# EasyEDA Pro project stm32_lora.eprj

# Schematic Schematic1
Board Name: Board1; Create Date: 2026-04-03; Page Name: P1; Project Name: pic24LoraAlpha; Schematic Name: Schematic1; Update Date: 2026-04-12; Company: EasyEDA.com; Page Size: A4; Version: V1.0
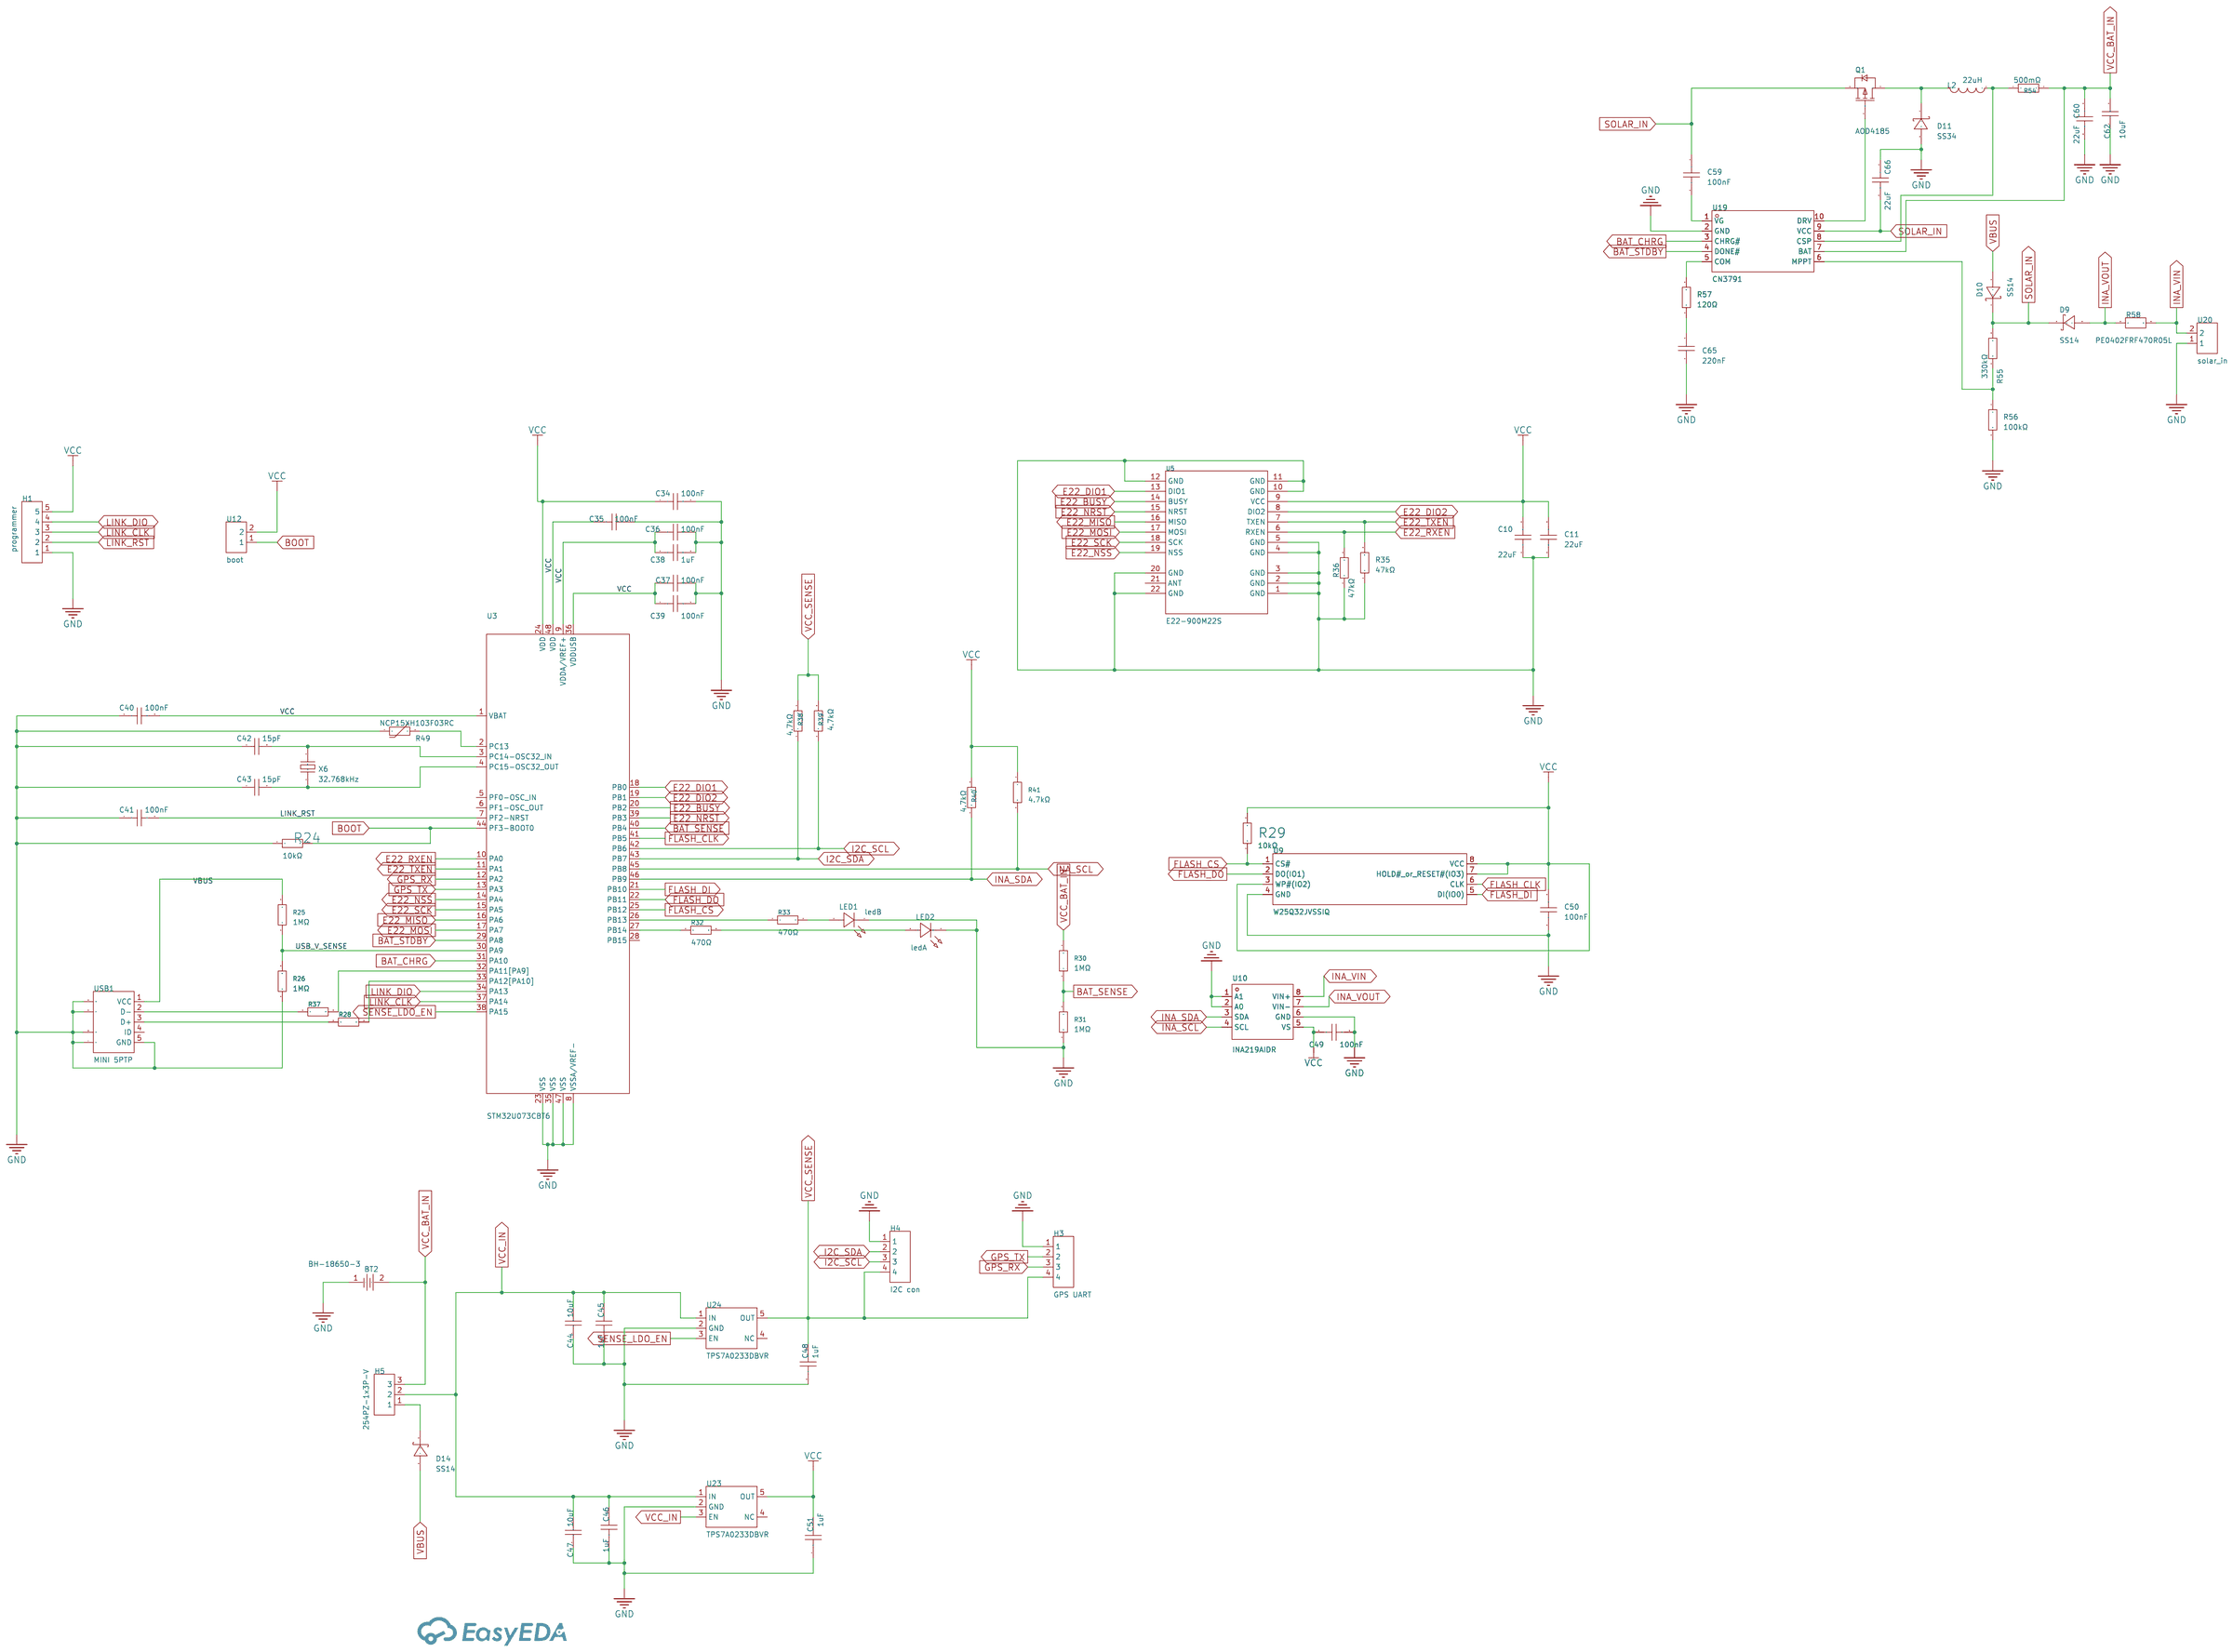
[diagram p0: schematic sheet]

## Parts
BT2  BH-18650-3  [BAT-TH_BH-18650-3]
C10  22uF  [C0603]
C11  22uF  [C0603]
C34  100nF  [C0402]
C35  100nF  [C0402]
C36  100nF  [C0402]
C37  100nF  [C0402]
C38  1uF  [C0402]
C39  100nF  [C0402]
C40  100nF  [C0402]
C41  100nF  [C0402]
C42  15pF  [C0402]
C43  15pF  [C0402]
C44  10uF  [C0402]
C45  1uF  [C0402]
C46  1uF  [C0402]
C47  10uF  [C0402]
C48  1uF  [C0402]
C49  100nF  [C0402]
C50  100nF  [C0402]
C51  1uF  [C0402]
C59  100nF  [C0402]
C60  22uF  [C0603]
C62  10uF  [C0402]
C65  220nF  [C0402]
C66  22uF  [C0603]
D9  SS14  [SMA_L4.2-W2.6-LS5.0-RD_1]
D10  SS14  [SMA_L4.2-W2.6-LS5.0-RD_1]
D11  SS34  [SMA_L4.3-W2.6-LS5.2-RD]
D14  SS14  [SMA_L4.2-W2.6-LS5.0-RD_1]
H1  programmer  [HDR-TH_5P-P2.54-V-M]  (no BOM)
H3  GPS UART  [HDR-TH_4P-HX-PH254-01-04-Z-L11.5]  (no BOM)
H4  I2C con  [HDR-TH_4P-HX-PH254-01-04-Z-L11.5]  (no BOM)
H5  254PZ-1x3P-V  [HDR-TH_3P-P2.54-V-M]  (no BOM)
L2  22uH  [IND-SMD_L4.0-W4.0_SLW4010S]
LED1  ledB  [LED0603-RD]  (no BOM)
LED2  ledA  [LED0603-RD]  (no BOM)
Q1  AOD4185  [TO-252-3_L6.5-W5.8-P4.60-LS9.9-BR]
R24  10kΩ  [R0603]
R25  1MΩ  [R0402]
R26  1MΩ  [R0402]
R28  22Ω  [R0402]
R29  10kΩ  [R0603]
R30  1MΩ  [R0402]
R31  1MΩ  [R0402]
R32  470Ω  [R0402]
R33  470Ω  [R0402]
R35  47kΩ  [R0402]
R36  47kΩ  [R0402]
R37  22Ω  [R0402]
R38  4.7kΩ  [R0402]
R39  4.7kΩ  [R0402]
R40  4.7kΩ  [R0402]
R41  4.7kΩ  [R0402]
R49  NCP15XH103F03RC  [R0402]
R54  500mΩ  [R0805]
R55  330kΩ  [R0603]
R56  100kΩ  [R0603]
R57  120Ω  [R0402]
R58  PE0402FRF470R05L  [R0402]
U3  STM32U073CBT6  [LFQFP-48_L7.0-W7.0-P0.50-LS9.0-BL]
U5  E22-900M22S  [WIRELM-SMD_E22-900M22S]
U9  W25Q32JVSSIQ  [SOIC-8_L5.3-W5.3-P1.27-LS8.0-BL]
U10  INA219AIDR  [SOIC-8_L4.9-W3.9-P1.27-LS6.0-BL]
U12  boot  [CONN-TH_HC-PZ254-11.5L-1X2PZ]  (no BOM)
U19  CN3791  [SSOP-10_L4.9-W3.9-P1.00-LS6.0-BL]
U20  solar_in  [CONN-TH_HC-PZ254-11.5L-1X2PZ]  (no BOM)
U23  TPS7A0233DBVR  [SOT-23-5_L2.9-W1.6-P0.95-LS2.8-BL]
U24  TPS7A0233DBVR  [SOT-23-5_L2.9-W1.6-P0.95-LS2.8-BL]
USB1  MINI 5PTP  [MINI-USB-SMD_MINI-5PTP]
X6  32.768kHz  [CRYSTAL-SMD_L3.2-W1.5-1]

## Library data of the parts
BT2 = BH-18650-3: Supplier Part: C49118397; Manufacturer: HanElectricity(瀚源); Supplier Footprint: 插件; JLCPCB Part Class: Extended Part; Datasheet: https://item.szlcsc.com/datasheet/BH-18650-3/51502451.html; Supplier: LCSC
C10 C11 C60 C66 = CL10A226MQ8NRNC: LCSC Part Name: 22uF ±20% 6.3V; Supplier Part: C59461; Manufacturer: SAMSUNG(三星); Supplier Footprint: 0603; JLCPCB Part Class: Basic Part; Datasheet: https://item.szlcsc.com/datasheet/CL10A226MQ8NRNC/60514.html; Supplier: LCSC; Tolerance: ±20%; Voltage Rating: 6.3V; Temperature Coefficient: X5R
C34-C37 C39-C41 C49 C50 C59 = CL05B104KO5NNNC: LCSC Part Name: 100nF ±10% 16V; Supplier Part: C1525; Manufacturer: SAMSUNG(三星); Supplier Footprint: 0402; JLCPCB Part Class: Basic Part; Datasheet: https://item.szlcsc.com/datasheet/CL05B104KO5NNNC/1877.html; Supplier: LCSC; Tolerance: ±10%; Voltage Rating: 16V; Temperature Coefficient: X7R
C38 C45 C46 C48 C51 = CL05A105KA5NQNC: LCSC Part Name: 1uF ±10% 25V; Supplier Part: C52923; Manufacturer: SAMSUNG(三星); Supplier Footprint: 0402; JLCPCB Part Class: Basic Part; Datasheet: https://item.szlcsc.com/datasheet/CL05A105KA5NQNC/53938.html; Supplier: LCSC; Tolerance: ±10%; Voltage Rating: 25V; Temperature Coefficient: X5R
C42 C43 = 0402CG150J500NT: LCSC Part Name: 15pF ±5% 50V; Supplier Part: C1548; Manufacturer: FH(风华); Supplier Footprint: 0402; JLCPCB Part Class: Basic Part; Datasheet: https://item.szlcsc.com/datasheet/0402CG150J500NT/1900.html; Supplier: LCSC; Tolerance: ±5%; Voltage Rating: 50V; Temperature Coefficient: C0G
C44 C47 C62 = CL05A106MQ5NUNC: LCSC Part Name: 10uF ±20% 6.3V; Supplier Part: C15525; Manufacturer: SAMSUNG(三星); Supplier Footprint: 0402; JLCPCB Part Class: Basic Part; Datasheet: https://item.szlcsc.com/datasheet/CL05A106MQ5NUNC/16204.html; Supplier: LCSC; Tolerance: ±20%; Voltage Rating: 6.3V; Temperature Coefficient: X5R
C65 = CL05B224KO5NNNC: LCSC Part Name: 220nF ±10% 16V; Supplier Part: C16772; Manufacturer: SAMSUNG(三星); Supplier Footprint: 0402; JLCPCB Part Class: Basic Part; Datasheet: https://item.szlcsc.com/datasheet/CL05B224KO5NNNC/17456.html; Supplier: LCSC; Tolerance: ±10%; Voltage Rating: 16V; Temperature Coefficient: X7R
D9 D10 D14 = SS14_C2480: LCSC Part Name: 电压:40V 电流:1A; Supplier Part: C2480; Manufacturer: MDD(辰达半导体); Supplier Footprint: SMA(DO-214AC); JLCPCB Part Class: Basic Part; Datasheet: https://item.szlcsc.com/datasheet/SS14/2857.html; Supplier: LCSC; Diode Configuration: Independent; Voltage - Forward(Vf@If): 550mV@1A; Voltage - DC Reverse(Vr): 40V; Current - Rectified: 1A; Reverse Leakage Current (Ir): 300uA@40V; Operating Junction Temperature Range: -55℃~+150℃; Non-Repetitive Peak Forward Surge Current: 25A
D11 = SS34_C8678: LCSC Part Name: 电压:40V 电流:3A; Supplier Part: C8678; Manufacturer: MDD(辰达半导体); Supplier Footprint: SMA(DO-214AC); JLCPCB Part Class: Basic Part; Datasheet: https://item.szlcsc.com/datasheet/SS34/9178.html; Supplier: LCSC; Diode Configuration: Independent; Voltage - Forward(Vf@If): 550mV@3A; Voltage - DC Reverse(Vr): 40V; Current - Rectified: 3A; Reverse Leakage Current (Ir): 500uA@40V; Operating Junction Temperature Range: -55℃~+125℃
H1 = 22284050: LCSC Part Name: 针座; Supplier Part: C563741; Manufacturer: MOLEX; Supplier Footprint: 插件; JLCPCB Part Class: Extended Part; Datasheet: https://www.molex.com/content/dam/molex/molex-dot-com/products/automated/en-us/salesdrawingpdf/423/42375/022284050_sd.pdf?inline\; Supplier: LCSC
H3 H4 = HX PH254-01-04-Z-L11.5 straight pin header: LCSC Part Name: 1x4P 间距:2.54mm 方针 直插; Supplier Part: C52016392; Manufacturer: hanxia(韩下); Supplier Footprint: 插件,P=2.54mm; JLCPCB Part Class: Extended Part; Datasheet: https://item.szlcsc.com/datasheet/HX%2520PH254-01-04-Z-L11.5%2520straight%2520pin%2520header/54760437.html; Supplier: LCSC; Pin Structure: 1x4P; Pitch: 2.54mm; Circluar Pins/Square Pins: Pin Header; Mounting Type: Through Hole; Number of Rows: 1; Number of Pins: 4P; Current Rating: 3A; Voltage Rating (Max): 1kV; Length of Mating Pin: 6mm; Insulation Height: 2.5mm; Length of End Connection Pin: 3mm; Contact Material: Brass; Contact Plating: Gold; Operating Temperature: -40℃~+105℃
H5 = 254PZ-1x3P-V: LCSC Part Name: 1x3P 间距:2.54mm 方针 直插; Supplier Part: C53055673; Manufacturer: LXWCONN(连兴旺电子); Supplier Footprint: 插件,P=2.54mm; JLCPCB Part Class: Extended Part; Datasheet: https://item.szlcsc.com/datasheet/254PZ-1x3P-V/55999873.html; Supplier: LCSC; Pin Structure: 1x3P; Pitch: 2.54mm; Circluar Pins/Square Pins: Pin Header; Mounting Type: Through Hole; Number of Rows: 1
L2 = SWPA4030S220MT: LCSC Part Name: 22uH ±20% 1.3A; Supplier Part: C83472; Manufacturer: Sunlord(顺络); Supplier Footprint: SMD; JLCPCB Part Class: Extended Part; Datasheet: https://atta.szlcsc.com/upload/public/pdf/source/20231024/317626D2AA2F8AB4113C1875E432E6E1.pdf; Supplier: LCSC; Tolerance: ±20%; Saturation Current (Isat): 1.3A
LED1 LED2 = 19-217/G7C-AM1N2B/6T: LCSC Part Name: 发光二极管; Supplier Part: C2987554; Manufacturer: EVERLIGHT(亿光); Supplier Footprint: 0603; JLCPCB Part Class: Extended Part; Supplier: LCSC; Illumination Color: Yellow Green; Voltage - Forward(Vf): 1.75V~2.35V; Power(Watts): 60mW; Wavelength - Dominant: 569.5nm~577.5nm; Peak Wavelength: 575nm; Lens Color: Water Clear; Luminous Intensity: 18mcd~45mcd; Viewing Angle: 120°; Operating Temperature: -40℃~+85℃
Q1 = AOD4185_C5261064: LCSC Part Name: 1个P沟道 耐压:40V 电流:40A; Supplier Part: C5261064; Manufacturer: HXY MOSFET(华轩阳电子); Supplier Footprint: TO-252-2L; JLCPCB Part Class: Extended Part; Datasheet: https://item.szlcsc.com/datasheet/AOD4185/5983763.html; Supplier: LCSC; Number: 1 P-Channel; Drain to Source Voltage: 40V; Current - Continuous Drain(Id): 40A; RDS(on): 19mΩ@10V; Pd - Power Dissipation: 40.3W; Input Capacitance(Ciss): 2.525nF
R24 R29 = 0603WAF1002T5E: LCSC Part Name: 厚膜电阻 10kΩ ±1% 100mW; Supplier Part: C25804; Manufacturer: UNI-ROYAL(厚声); Supplier Footprint: 0603; JLCPCB Part Class: Basic Part; Datasheet: https://item.szlcsc.com/datasheet/0603WAF1002T5E/26547.html; Supplier: LCSC; Type: Thick Film Resistor; Tolerance: ±1%; Power(Watts): 100mW; Voltage-Supply(Max): 75V; Temperature Coefficient: ±100ppm/℃; Operating Temperature: -55℃~+155℃
R25 R26 R30 R31 = 0402WGF1004TCE: LCSC Part Name: 1MΩ ±1% 62.5mW 厚膜电阻; Supplier Part: C26083; Manufacturer: UNI-ROYAL(厚声); Supplier Footprint: 0402; JLCPCB Part Class: Basic Part; Datasheet: https://item.szlcsc.com/datasheet/0402WGF1004TCE/26826.html; Supplier: LCSC; Type: Thick Film Resistor; Tolerance: ±1%; Power(Watts): 62.5mW; Voltage-Supply(Max): 50V; Temperature Coefficient: ±100ppm/℃; Operating Temperature: -55℃~+155℃
R28 R37 = 0402WGF220JTCE: LCSC Part Name: 22Ω ±1% 62.5mW 厚膜电阻; Supplier Part: C25092; Manufacturer: UNI-ROYAL(厚声); Supplier Footprint: 0402; JLCPCB Part Class: Basic Part; Datasheet: https://atta.szlcsc.com/upload/public/pdf/source/20200306/C422600_1E6D84923E4A46A82E41ADD87F860B5C.pdf; Supplier: LCSC; Type: Thick Film Resistors; Tolerance: ±1%; Temperature Coefficient: ±100ppm/℃; Operating Temperature Range: -55℃~+155℃
R32 R33 = 0402WGF4700TCE: LCSC Part Name: 470Ω ±1% 62.5mW 厚膜电阻; Supplier Part: C25117; Manufacturer: UNI-ROYAL(厚声); Supplier Footprint: 0402; JLCPCB Part Class: Basic Part; Datasheet: https://item.szlcsc.com/datasheet/0402WGF4700TCE/25860.html; Supplier: LCSC; Type: Thick Film Resistor; Tolerance: ±1%; Power(Watts): 62.5mW; Voltage-Supply(Max): 50V; Temperature Coefficient: ±100ppm/℃; Operating Temperature: -55℃~+155℃
R35 R36 = 0402WGF4702TCE: LCSC Part Name: 47kΩ ±1% 62.5mW 厚膜电阻; Supplier Part: C25792; Manufacturer: UNI-ROYAL(厚声); Supplier Footprint: 0402; JLCPCB Part Class: Basic Part; Datasheet: https://item.szlcsc.com/datasheet/0402WGF4702TCE/26535.html; Supplier: LCSC; Type: Thick Film Resistor; Tolerance: ±1%; Power(Watts): 62.5mW; Voltage-Supply(Max): 50V; Temperature Coefficient: ±100ppm/℃; Operating Temperature: -55℃~+155℃
R38-R41 = 0402WGF4701TCE: LCSC Part Name: 4.7kΩ ±1% 62.5mW 厚膜电阻; Supplier Part: C25900; Manufacturer: UNI-ROYAL(厚声); Supplier Footprint: 0402; JLCPCB Part Class: Basic Part; Datasheet: https://item.szlcsc.com/datasheet/0402WGF4701TCE/26643.html; Supplier: LCSC; Type: Thick Film Resistor; Tolerance: ±1%; Power(Watts): 62.5mW; Voltage-Supply(Max): 50V; Temperature Coefficient: ±100ppm/℃; Operating Temperature: -55℃~+155℃
R49 = NCP15XH103F03RC: LCSC Part Name: 10kΩ 3380K 100mW; Supplier Part: C77131; Manufacturer: muRata(村田); Supplier Footprint: 0402; JLCPCB Part Class: Extended Part; Datasheet: https://item.szlcsc.com/datasheet/NCP15XH103F03RC/78258.html; Supplier: LCSC; Resistance @ 25℃: 10kΩ; B Constant (25℃/50℃): 3380K; Resistance Tolerance: ±1%; B Constant (25℃/85℃): 3434K; B Constant (25℃/100℃): 3455K; Power(Watts): 100mW; B Constant Tolerance: ±1%; Steady State Current (Max): 310uA; Operating Temperature: -40℃~+125℃; Dissipation Factor: 1mW/℃; Length: 1mm; Width: 0.5mm
R54 = 0805W8F500LT5E: LCSC Part Name: 500mΩ ±1% 125mW 厚膜电阻; Supplier Part: C28319; Manufacturer: UNI-ROYAL(厚声); Supplier Footprint: 0805; JLCPCB Part Class: Extended Part; Datasheet: https://atta.szlcsc.com/upload/public/pdf/source/20200306/C422600_1E6D84923E4A46A82E41ADD87F860B5C.pdf; Supplier: LCSC; Type: Thick Film Resistors; Tolerance: ±1%; Temperature Coefficient: ±800ppm/℃; Operating Temperature Range: -55℃~+155℃
R55 = 0603WAF3303T5E: LCSC Part Name: 330kΩ ±1% 100mW 厚膜电阻; Supplier Part: C23137; Manufacturer: UNI-ROYAL(厚声); Supplier Footprint: 0603; JLCPCB Part Class: Basic Part; Datasheet: https://atta.szlcsc.com/upload/public/pdf/source/20200306/C422600_1E6D84923E4A46A82E41ADD87F860B5C.pdf; Supplier: LCSC; Type: Thick Film Resistors; Tolerance: ±1%; Temperature Coefficient: ±100ppm/℃; Operating Temperature Range: -55℃~+155℃
R56 = 0603WAF1003T5E: LCSC Part Name: 100kΩ ±1% 100mW 厚膜电阻; Supplier Part: C25803; Manufacturer: UNI-ROYAL(厚声); Supplier Footprint: 0603; JLCPCB Part Class: Basic Part; Datasheet: https://item.szlcsc.com/datasheet/0603WAF1003T5E/26546.html; Supplier: LCSC; Type: Thick Film Resistor; Tolerance: ±1%; Power(Watts): 100mW; Voltage-Supply(Max): 75V; Temperature Coefficient: ±100ppm/℃; Operating Temperature: -55℃~+155℃
R57 = 0402WGF1200TCE: LCSC Part Name: 120Ω ±1% 62.5mW 厚膜电阻; Supplier Part: C25079; Manufacturer: UNI-ROYAL(厚声); Supplier Footprint: 0402; JLCPCB Part Class: Basic Part; Datasheet: https://item.szlcsc.com/datasheet/0402WGF1200TCE/25822.html; Supplier: LCSC; Type: Thick Film Resistor; Tolerance: ±1%; Power(Watts): 62.5mW; Voltage-Supply(Max): 50V; Temperature Coefficient: ±100ppm/℃; Operating Temperature: -55℃~+155℃
R58 = PE0402FRF470R05L: LCSC Part Name: 薄膜电阻 50mΩ ±1% 250mW; Supplier Part: C851623; Manufacturer: YAGEO(国巨); Supplier Footprint: 0402; JLCPCB Part Class: Extended Part; Datasheet: https://item.szlcsc.com/datasheet/PE0402FRF470R05L/911941.html; Supplier: LCSC
U3 = STM32U073CBT6: Supplier Part: C27035627; Manufacturer: ST(意法半导体); Supplier Footprint: LQFP-48(7x7); JLCPCB Part Class: Extended Part; Datasheet: https://item.szlcsc.com/datasheet/STM32U073CBT6/28775735.html; Supplier: LCSC
U5 = E22-900M22S: LCSC Part Name: 868/915MHz贴片型LoRa模块; Supplier Part: C411293; Manufacturer: EBYTE(亿佰特); Supplier Footprint: SMD,20x14mm; JLCPCB Part Class: Extended Part; Datasheet: https://item.szlcsc.com/datasheet/E22-900M22S/402604.html; Supplier: LCSC; Output Power: 22.3dBm; Interface Type: SPI; Modulation System: LoRa；FSK; Voltage - Supply: 2.5V~3.7V; Antenna Type: Stamp Hole Antenna；IPEX interface; Receive  Current: 6.8mA; Send  Current: 119mA; Sensitivity: -147dBm; Communication Distance: 7km
U9 = W25Q32JVSSIQ: LCSC Part Name: 支持双线、四线SPI接口的3V、32Mbit 串行SPI闪存; Supplier Part: C179173; Manufacturer: Winbond(华邦); Supplier Footprint: SOIC-8-208mil; JLCPCB Part Class: Extended Part; Datasheet: https://item.szlcsc.com/datasheet/W25Q32JVSSIQ/190567.html; Supplier: LCSC; Interface: SPI; Memory Size: 32Mbit; Clock Frequency: 133MHz; Voltage - Supply: 2.7V~3.6V; Standby Supply Current: 1uA; Program / Erase Cycles: 100,000 Cycles; Page Programming Time (Tpp): 3ms; Data Retention - TDR (Year): 20 Years; Operating Temperature: -40℃~+85℃
U10 = INA219AIDR: LCSC Part Name: 零漂移双向电流/功率监测器带I2C接口; Supplier Part: C138706; Manufacturer: TI(德州仪器); Supplier Footprint: SOIC-8; JLCPCB Part Class: Extended Part; Datasheet: https://www.ti.com/cn/lit/gpn/ina219; Supplier: LCSC; Number of Channels: 1; Vcm - Common Mode Voltage: 0V~26V; Ib - Input Bias Current: 20nA; Vos - Input Offset Voltage: 10uV; Operating Temperature: -40℃~+125℃; Differential Voltage: ±26V; Maximum Power Supply Range (Vdd-Vss): 5.5V; Single Supply: 3V~5.5V; Quiescent Current: 700uA; Input Offset Voltage Drift(Vos TC): 0.1uV/℃; Common Mode Rejection Ratio (CMRR): 120dB
U12 U20 = HC-PZ254-11.5L-1x2PZ: LCSC Part Name: 1x2P 间距:2.54mm 方针 直插; Supplier Part: C27985187; Manufacturer: HC(虹成电子); Supplier Footprint: 插件,P=2.54mm; JLCPCB Part Class: Extended Part; Datasheet: https://item.szlcsc.com/datasheet/HC-PZ254-11.5L-1x2PZ/29721145.html; Supplier: LCSC; Pin Structure: 1x2P; Pitch: 2.54mm; Circluar Pins/Square Pins: Pin Header; Mounting Type: Through Hole; Number of Rows: 1; Number of Pins: 2P; Current Rating: 3A; Length of Mating Pin: 6mm; Insulation Height: 2.5mm; Length of End Connection Pin: 3mm; Contact Material: Brass; Contact Plating: Gold; Operating Temperature: -40℃~+105℃; Color: Black
U19 = CN3791: LCSC Part Name: 具有太阳能电池最大功率点跟踪功能的4A单节锂电池充电管理集成电路; Supplier Part: C154992; Manufacturer: CONSONANCE(上海如韵); Supplier Footprint: SSOP-10-150mil; JLCPCB Part Class: Extended Part; Datasheet: https://item.szlcsc.com/datasheet/CN3791/166334.html; Supplier: LCSC; The Chip Type: Charging IC; Voltage - Supply: 4.5V~28V; Charge Current - Max: 4A; Charging Saturation Voltage: 4.2V; Type of Battery: Lithium Battery; Number of Cells: 1; Operating Temperature: -40℃~+85℃; Battery Temperature Detection: Not supported; Supply Current (Iq): 15uA; Features: Constant voltage charging；Constant current charging；Charge termination；Automatic recharge；Soft start；Programmable charging current；Overvoltage protection；Undervoltage lockout；Trickle charging
U23 U24 = TPS7A0233DBVR: LCSC Part Name: 具有使能功能的 200mA、毫微功耗 IQ (25nA)、低压降 (LDO) 稳压器; Supplier Part: C5142805; Manufacturer: TI(德州仪器); Supplier Footprint: SOT-23-5; JLCPCB Part Class: Extended Part; Datasheet: https://www.ti.com/cn/lit/gpn/tps7a02; Supplier: LCSC; Output Type: Fixed; Voltage - Supply: 6V; Output Voltage: 3.3V; Output Current: 200mA; Power Supply Rejection Ratio (PSRR): 55dB@(1kHz); Voltage Dropout: 270mV@(200mA); standby current: 25nA; Noise: 130uVrms; Features: Thermal Shutdown；Enable；Over Temperature Protection；Over Current Protection; Operating Temperature: -40℃~+125℃@(Tj); Output Configuration: Positive; Number of Outputs: 1
USB1 = MINI 5PTP: LCSC Part Name: 5P卧贴母座; Supplier Part: C2681563; Manufacturer: SHOU HAN(首韩); Supplier Footprint: SMD; JLCPCB Part Class: Extended Part; Datasheet: https://item.szlcsc.com/datasheet/MINI%25205PTP/2774906.html; Supplier: LCSC; Connector Type: Mini-B; Protocol Standard: USB 2.0; Gender: Female; Mounting Type: Surface Mount, Right Angle; Number of Contacts: 5P; Number of Ports: 1; Current Rating-Power: 1A; Voltage Rating: 30V; Connect-Disconnect Life: 3,000 Cycles; Detection color: Black; Operating Temperature: -30℃~+80℃
X6 = FC-135R 32.7680KA-A3: LCSC Part Name: 32.768kHz ±20ppm 12.5pF; Supplier Part: C6554955; Manufacturer: EPSON(爱普生); Supplier Footprint: SMD3215-2P; JLCPCB Part Class: Extended Part; Datasheet: https://item.szlcsc.com/datasheet/FC-135R%252032.7680KA-A3/7508731.html; Supplier: LCSC; Normal temperature Frequency Tolerance: ±20ppm; Load Capacitance: 12.5pF; Equivalent Series Resistance(ESR): 50kΩ; Operating Temperature: -40℃~+85℃

## Nets
GND: BT2.1(-) C10.1 C11.1 C34.2 C35.2 C36.2 C37.2 C38.2 C39.2 C40.1 C41.1 C42.1 C43.1 C44.1 C45.1 C46.1 C47.1 C48.1 C49.2 C50.1 C51.1 C60.2 C62.1 C65.1 C66.1 D11.2(A) H1.1 H3.1 H4.1 LED1.1(K) LED2.1(K) R24.1 R26.1 R31.1 R35.1 R36.1 R49.1 R56.2 U3.8(VSSA/VREF-) U3.23(VSS) U3.35(VSS) U3.47(VSS) U5.1(GND) U5.2(GND) U5.3(GND) U5.4(GND) U5.5(GND) U5.10(GND) U5.11(GND) U5.12(GND) U5.20(GND) U5.22(GND) U9.4(GND) U10.1(A1) U10.2(A0) U10.6(GND) U19.2(GND) U20.1 U23.2(GND) U24.2(GND) USB1.5(GND) USB1.6(EH) USB1.7(EH) USB1.8(EH) USB1.9(EH)
VBUS: D10.2(A) D14.2(A) R25.2 USB1.1(VCC)
VCC: C10.2 C11.2 C34.1 C35.1 C36.1 C37.1 C38.1 C39.1 C40.2 C49.1 C50.2 C51.2 H1.5 R29.2 R40.2 R41.1 U3.1(VBAT) U3.9(VDDA/VREF+) U3.24(VDD) U3.36(VDDUSB) U3.48(VDD) U5.9(VCC) U9.3(WP#(IO2)) U9.7(HOLD# or RESET#(IO3)) U9.8(VCC) U10.5(VS) U12.2 U23.5(OUT)
VCC_BAT_IN: BT2.2(+) C60.1 C62.2 H5.3 R30.2 R54.2 U19.7(BAT)
VCC_IN: C44.2 C45.2 C46.2 C47.2 H5.2 U23.1(IN) U23.3(EN) U24.1(IN)
VCC_SENSE: C48.2 H3.4 H4.4 R38.2 R39.2 U24.5(OUT)
BAT_CHRG: U3.31(PA10) U19.3(CHRG#)
BAT_SENSE: R30.1 R31.2 U3.40(PB4)
BAT_STDBY: U3.29(PA8) U19.4(DONE#)
BOOT: R24.2 U3.44(PF3-BOOT0) U12.1
E22_BUSY: U3.20(PB2) U5.14(BUSY)
E22_DIO1: U3.18(PB0) U5.13(DIO1)
E22_DIO2: U3.19(PB1) U5.8(DIO2)
E22_MISO: U3.16(PA6) U5.16(MISO)
E22_MOSI: U3.17(PA7) U5.17(MOSI)
E22_NRST: U3.39(PB3) U5.15(NRST)
E22_NSS: U3.14(PA4) U5.19(NSS)
E22_RXEN: R36.2 U3.10(PA0) U5.6(RXEN)
E22_SCK: U3.15(PA5) U5.18(SCK)
E22_TXEN: R35.2 U3.11(PA1) U5.7(TXEN)
FLASH_CLK: U3.41(PB5) U9.6(CLK)
FLASH_CS: R29.1 U3.25(PB12) U9.1(CS#)
FLASH_DI: U3.21(PB10) U9.5(DI(IO0))
FLASH_DO: U3.22(PB11) U9.2(DO(IO1))
GPS_RX: H3.3 U3.12(PA2)
GPS_TX: H3.2 U3.13(PA3)
I2C_SCL: H4.3 R39.1 U3.42(PB6)
I2C_SDA: H4.2 R38.1 U3.43(PB7)
INA_SCL: R41.2 U3.45(PB8) U10.4(SCL)
INA_SDA: R40.1 U3.46(PB9) U10.3(SDA)
INA_VIN: R58.2 U10.8(VIN+) U20.2
INA_VOUT: D9.2(A) R58.1 U10.7(VIN-)
LINK_CLK: H1.3 U3.37(PA14)
LINK_DIO: H1.4 U3.34(PA13)
LINK_RST: C41.2 H1.2 U3.7(PF2-NRST)
SENSE_LDO_EN: U3.38(PA15) U24.3(EN)
SOLAR_IN: C59.1 C66.2 D9.1(K) D10.1(K) Q1.3(S) R55.2 U19.9(VCC)
USB_DP: R28.2 U3.33(PA12[PA10])
USB_V_SENSE: R25.1 R26.2 U3.30(PA9)
$1N4771: R28.1 USB1.3(D+)
$1N10468: R33.1 U3.26(PB13)
$1N10470: R32.1 U3.27(PB14)
$1N10516: LED1.2(A) R33.2
$1N10562: LED2.2(A) R32.2
$1N10899: C42.2 U3.3(PC14-OSC32_IN) X6.2(GND)
$1N10903: C43.2 U3.4(PC15-OSC32_OUT) X6.1
$1N31992: R37.2 U3.32(PA11[PA9])
$1N32156: R37.1 USB1.2(D-)
$1N34283: R49.2 U3.2(PC13)
$1N35924: Q1.1(G) U19.10(DRV)
$1N35929: D11.1(K) L2.2 Q1.2(D)
$1N36102: L2.1 R54.1 U19.8(CSP)
$1N36152: R55.1 R56.1 U19.6(MPPT)
$1N36318: C59.2 U19.1(VG)
$1N36427: C65.2 R57.1
$1N36456: R57.2 U19.5(COM)
$1N41677: D14.1(K) H5.1

Not connected (* = marked no-connect by the designer): U3 5(PF0-OSC_IN) 6(PF1-OSC_OUT) 28(PB15); U5 21(ANT); U23 4(NC); U24 4(NC); USB1 4(ID)

# Board PCB1
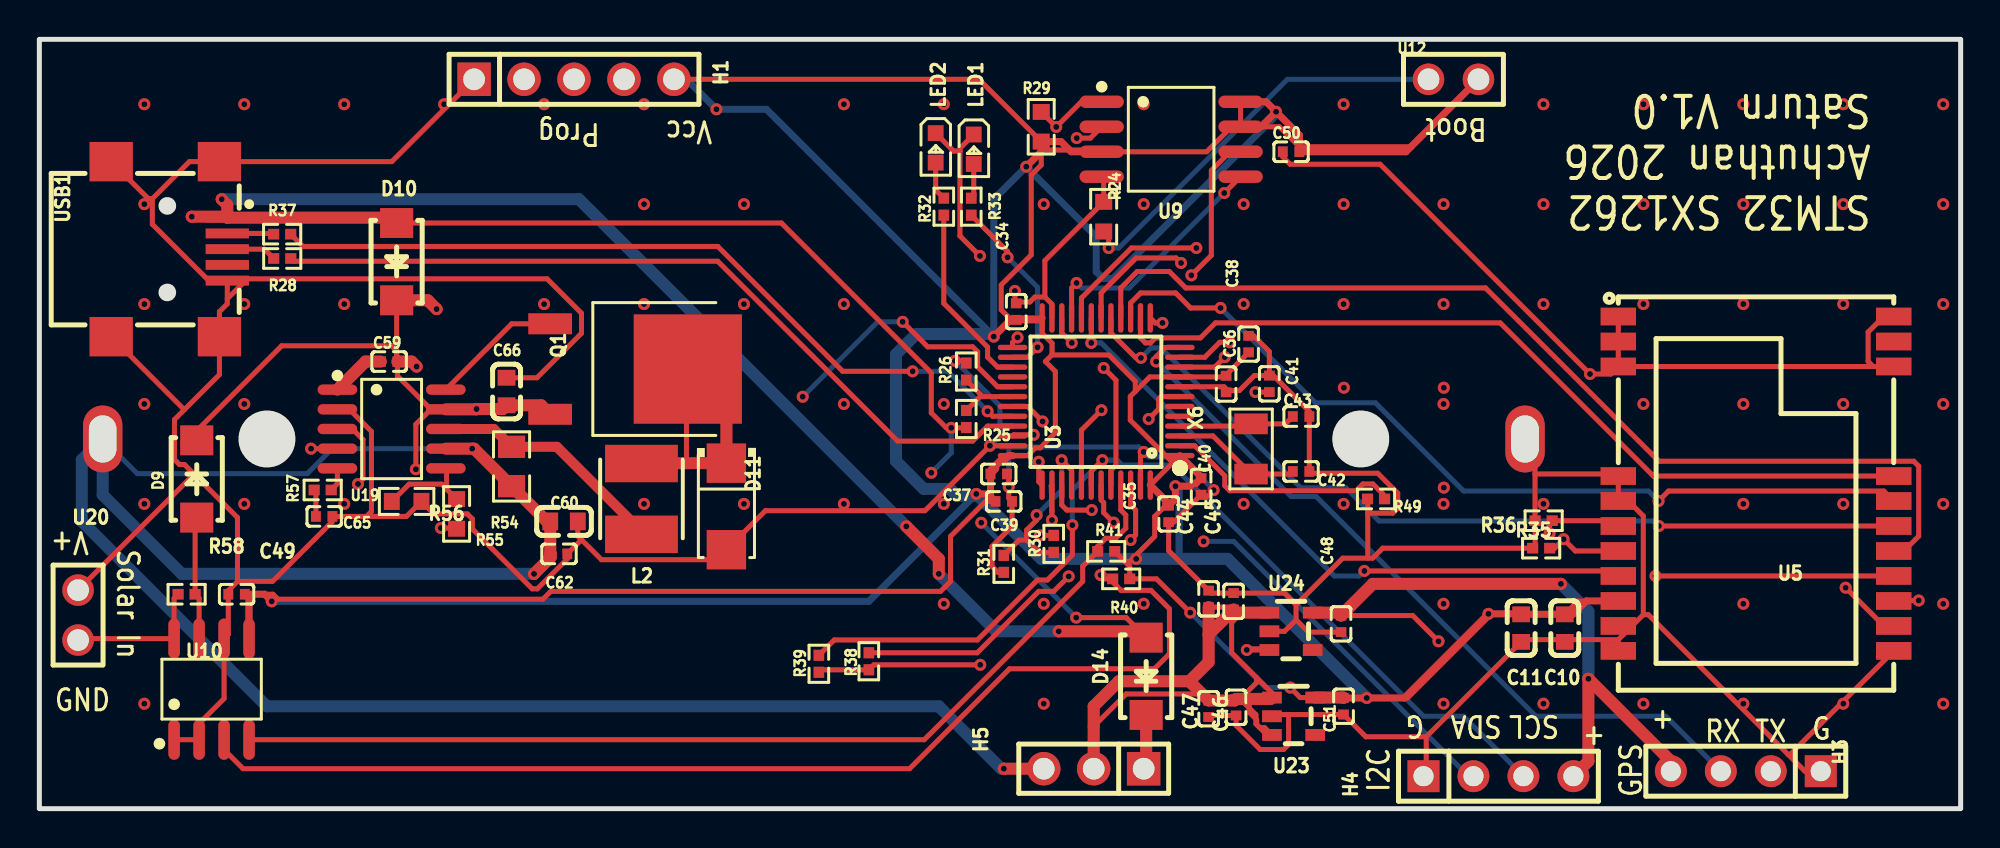
[diagram p1: board, top side]
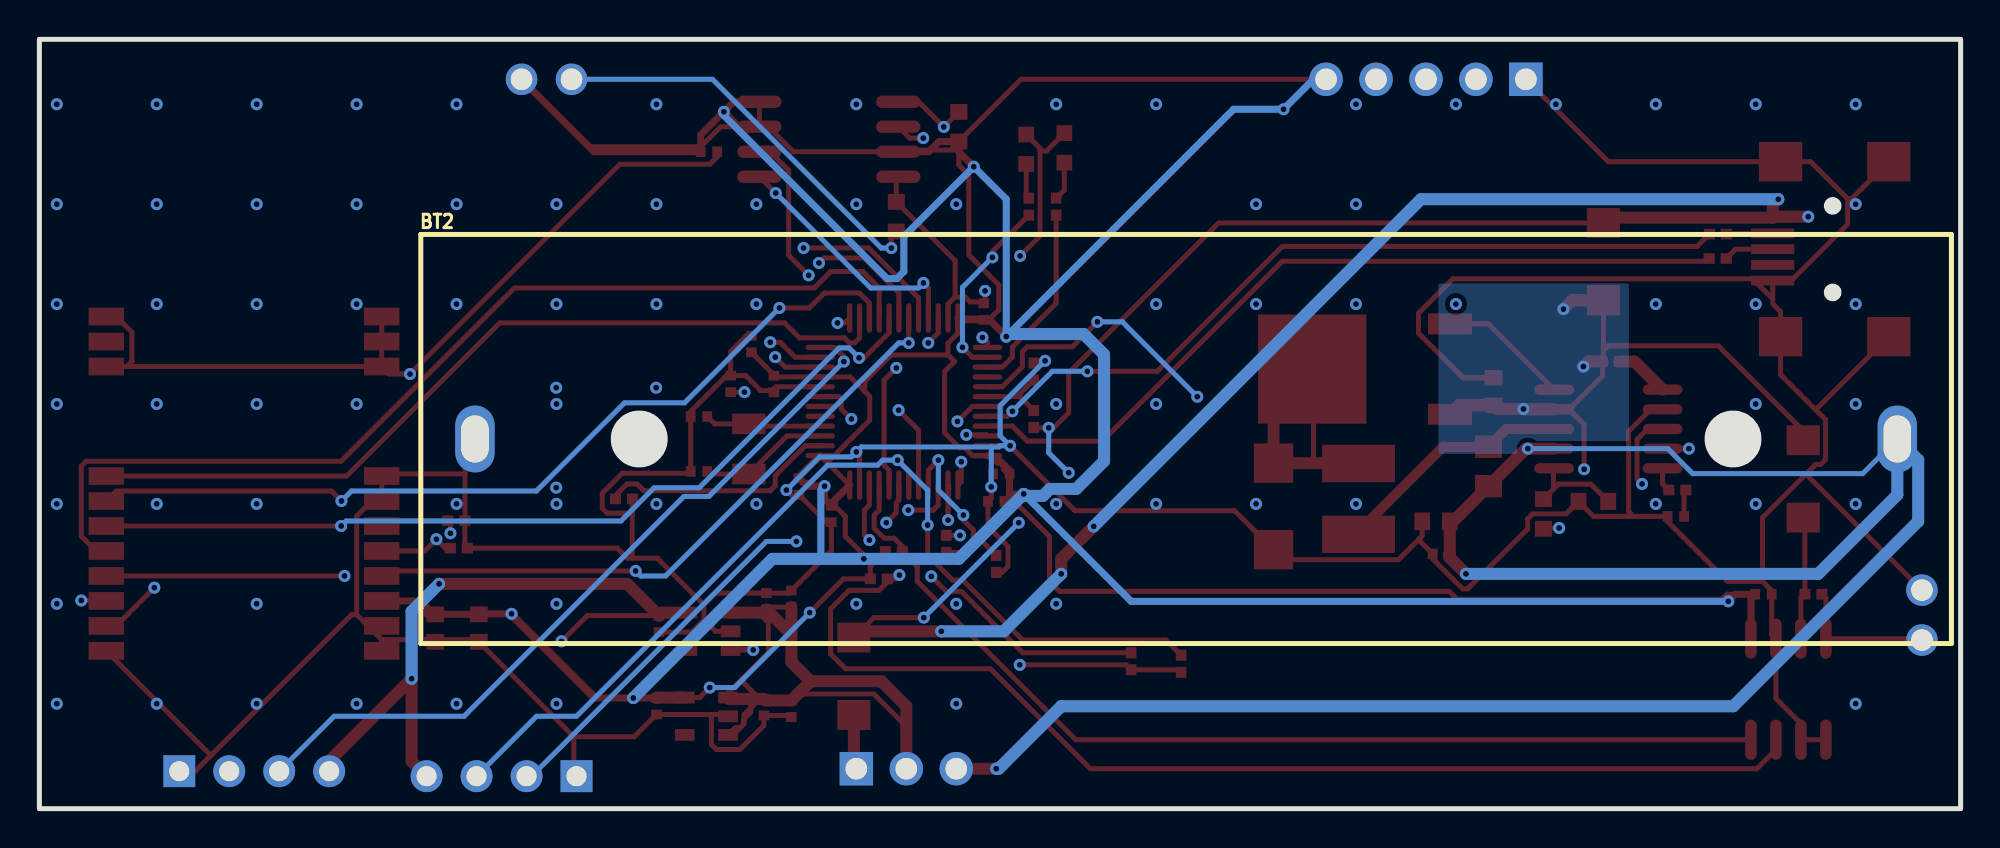
[diagram p2: board, bottom side, seen from below]

Outline 97.66 x 39.12 mm; copper layers: Top Layer, Signal, GND, Bottom Layer. Coordinates in mm from the lower left corner of the outline.
Outline path: rectangle 0,39.12 97.66,0
Stack: Top Layer 0.035mm Outer layer thickness 1oz / Dielectric1 0.2104mm 7628 RC49% 8.6mil / Signal 0.0152mm Inner layer thickness / Dielectric2 1.065mm 1.1mm H/HOZ Copper / GND 0.0152mm Inner layer thickness / Dielectric3 0.2104mm 7628 RC49% 8.6mil / Bottom Layer 0.035mm Outer layer thickness 1oz

## Design rules (mm)
template: Custom Config
spacing copperThickness1oz (default): track to track 0.102, other pairs 0.152 to 0.3
spacing copperThickness2oz: track to track 0.203, other pairs 0.152 to 0.3
track width copperThickness1oz (default): min 0.127, default 0.254, max 2.54
track width copperThickness2oz: min 0.203, default 0.254, max 2.54
differential pair differentialPair (default): width min 0.127, default 0.254, max 2.54; gap min 0.152, default 0.152
via viaSize (default): diameter min 0.5, default 0.61, max 10; hole min 0.3, default 0.305, max 6.3
net GND uses innerPlane1

## Placement (name value [footprint] x y rotation side)
BT2  BH-18650-3  [BAT-TH_BH-18650-3]  39.37 18.8 180 bottom
C10  22uF  [C0603]  77.54 9.18 90 top
C11  22uF  [C0603]  75.32 9.18 90 top
C34  100nF  [C0402]  49.66 25.27 90 top
C35  100nF  [C0402]  57.4 14.99 270 top
C36  100nF  [C0402]  60.33 21.59 270 top
C37  100nF  [C0402]  48.77 17.02 0 top
C38  1uF  [C0402]  61.47 23.62 90 top
C39  100nF  [C0402]  49.02 15.62 0 top
C40  100nF  [C0402]  59.05 16.38 90 top
C41  100nF  [C0402]  62.52 21.6 270 top
C42  15pF  [C0402]  64.14 17.15 180 top
C43  15pF  [C0402]  64.14 19.94 180 top
C44  10uF  [C0402]  59.44 10.67 270 top
C45  1uF  [C0402]  60.71 10.54 270 top
C46  1uF  [C0402]  60.83 5.16 90 top
C47  10uF  [C0402]  59.44 5.08 90 top
C48  1uF  [C0402]  66.17 9.4 90 top
C49  100nF  [C0402]  10.03 10.9 180 top
C50  100nF  [C0402]  63.63 33.4 0 top
C51  1uF  [C0402]  66.29 5.21 90 top
C59  100nF  [C0402]  17.78 22.73 180 top
C60  22uF  [C0603]  26.67 14.61 0 top
C62  10uF  [C0402]  26.42 12.95 180 top
C65  220nF  [C0402]  14.48 14.86 180 top
C66  22uF  [C0603]  23.75 21.21 270 top
D9  SS14  [SMA_L4.2-W2.6-LS5.0-RD_1]  8 16.76 270 top
D10  SS14  [SMA_L4.2-W2.6-LS5.0-RD_1]  18.16 27.81 90 top
D11  SS34  [SMA_L4.3-W2.6-LS5.2-RD]  34.92 15.37 270 top
D14  SS14  [SMA_L4.2-W2.6-LS5.0-RD_1]  56.26 6.73 90 top
H1  programmer  [HDR-TH_5P-P2.54-V-M]  27.18 37.08 0 top
H3  GPS UART  [HDR-TH_4P-HX-PH254-01-04-Z-L11.5]  86.74 1.91 180 top
H4  I2C con  [HDR-TH_4P-HX-PH254-01-04-Z-L11.5]  74.17 1.65 0 top
H5  254PZ-1x3P-V  [HDR-TH_3P-P2.54-V-M]  53.59 2.03 180 top
L2  22uH  [IND-SMD_L4.0-W4.0_SLW4010S]  30.61 15.75 90 top
LED1  ledB  [LED0603-RD]  47.5 33.53 270 top
LED2  ledA  [LED0603-RD]  45.56 33.6 270 top
Q1  AOD4185  [TO-252-3_L6.5-W5.8-P4.60-LS9.9-BR]  29.46 22.35 180 top
R24  10kΩ  [R0603]  54.1 30.1 270 top
R25  1MΩ  [R0402]  47.12 19.81 270 top
R26  1MΩ  [R0402]  47.12 22.23 270 top
R28  22Ω  [R0402]  12.35 27.97 0 top
R29  10kΩ  [R0603]  50.93 34.67 270 top
R30  1MΩ  [R0402]  51.56 13.46 90 top
R31  1MΩ  [R0402]  49.02 12.45 90 top
R32  470Ω  [R0402]  45.97 30.61 90 top
R33  470Ω  [R0402]  47.37 30.61 90 top
R35  47kΩ  [R0402]  76.34 13.25 0 top
R36  47kΩ  [R0402]  76.47 14.64 0 top
R37  22Ω  [R0402]  12.34 29.21 0 top
R38  4.7kΩ  [R0402]  42.16 7.49 270 top
R39  4.7kΩ  [R0402]  39.62 7.37 270 top
R40  4.7kΩ  [R0402]  54.99 11.68 0 top
R41  4.7kΩ  [R0402]  54.23 13.08 180 top
R49  NCP15XH103F03RC  [R0402]  67.95 15.75 0 top
R54  500mΩ  [R0805]  24 17.4 270 top
R55  330kΩ  [R0603]  21.21 14.99 270 top
R56  100kΩ  [R0603]  18.67 15.62 0 top
R57  120Ω  [R0402]  14.4 16.2 0 top
R58  PE0402FRF470R05L  [R0402]  7.49 10.9 180 top
U3  STM32U073CBT6  [LFQFP-48_L7.0-W7.0-P0.50-LS9.0-BL]  53.72 20.7 90 top
U5  E22-900M22S  [WIRELM-SMD_E22-900M22S]  87.26 16.52 180 top
U9  W25Q32JVSSIQ  [SOIC-8_L5.3-W5.3-P1.27-LS8.0-BL]  57.53 34.04 270 top
U10  INA219AIDR  [SOIC-8_L4.9-W3.9-P1.27-LS6.0-BL]  8.76 6.08 0 top
U12  boot  [CONN-TH_HC-PZ254-11.5L-1X2PZ]  71.88 37.08 0 top
U19  CN3791  [SSOP-10_L4.9-W3.9-P1.00-LS6.0-BL]  17.91 19.3 270 top
U20  solar_in  [CONN-TH_HC-PZ254-11.5L-1X2PZ]  1.97 9.84 270 top
U23  TPS7A0233DBVR  [SOT-23-5_L2.9-W1.6-P0.95-LS2.8-BL]  63.75 4.7 270 top
U24  TPS7A0233DBVR  [SOT-23-5_L2.9-W1.6-P0.95-LS2.8-BL]  63.63 9.02 270 top
USB1  MINI 5PTP  [MINI-USB-SMD_MINI-5PTP]  6.6 28.45 270 top
X6  32.768kHz  [CRYSTAL-SMD_L3.2-W1.5-1]  61.6 18.29 270 top

## Footprints (pads in the part's own frame, mm; a bottom-side part is the same pattern mirrored in y, then rotated)
BAT-TH_BH-18650-3
  oval 2x3.4 hole 1.4x2.4: 1(-36.15,0) 2(36.15,0)
C0402
  rect 0.5x0.54 smd: 1(-0.42,0) 2(0.42,0)
C0603
  rect 0.8x0.9 smd: 1(-0.7,0) 2(0.7,0)
CONN-TH_HC-PZ254-11.5L-1X2PZ
  round 1.6 hole 1.1: 1(-1.27,0) 2(1.27,0)
CRYSTAL-SMD_L3.2-W1.5-1
  rect 1.05x1.7 smd: 1(-1.275,0) 2(1.275,0)
HDR-TH_3P-P2.54-V-M
  rect 1.7x1.7 hole 1.1: 1(-2.54,0)
  round 1.7 hole 1.1: 2(0,0) 3(2.54,0)
HDR-TH_4P-HX-PH254-01-04-Z-L11.5
  rect 1.62x1.62 hole 1.02: 1(-3.81,0)
  round 1.62 hole 1.02: 2(-1.27,0) 3(1.27,0) 4(3.81,0)
HDR-TH_5P-P2.54-V-M
  rect 1.7x1.7 hole 1.1: 1(-5.08,0)
  round 1.7 hole 1.1: 2(-2.54,0) 3(0,0) 4(2.54,0) 5(5.08,0)
IND-SMD_L4.0-W4.0_SLW4010S
  rect 1.9x3.7 smd: 1(-1.8,0) 2(1.8,0)
LED0603-RD
  rect 0.8x0.8 smd: 1(-0.749,0) 2(0.749,0)
LFQFP-48_L7.0-W7.0-P0.50-LS9.0-BL
  oval 0.27x1.5 smd: 1(-2.75,-4.25) 2(-2.25,-4.25) 3(-1.75,-4.25) 4(-1.25,-4.25) 5(-0.75,-4.25) 6(-0.25,-4.25) 7(0.25,-4.25) 8(0.75,-4.25) 9(1.25,-4.25) 10(1.75,-4.25) 11(2.25,-4.25) 12(2.75,-4.25) 25(2.75,4.25) 26(2.25,4.25) 27(1.75,4.25) 28(1.25,4.25) 29(0.75,4.25) 30(0.25,4.25) 31(-0.25,4.25) 32(-0.75,4.25) 33(-1.25,4.25) 34(-1.75,4.25) 35(-2.25,4.25) 36(-2.75,4.25)
  oval 1.5x0.27 smd: 13(4.25,-2.75) 14(4.25,-2.25) 15(4.25,-1.75) 16(4.25,-1.25) 17(4.25,-0.75) 18(4.25,-0.25) 19(4.25,0.25) 20(4.25,0.75) 21(4.25,1.25) 22(4.25,1.75) 23(4.25,2.25) 24(4.25,2.75) 37(-4.25,2.75) 38(-4.25,2.25) 39(-4.25,1.75) 40(-4.25,1.25) 41(-4.25,0.75) 42(-4.25,0.25) 43(-4.25,-0.25) 44(-4.25,-0.75) 45(-4.25,-1.25) 46(-4.25,-1.75) 47(-4.25,-2.25) 48(-4.25,-2.75)
MINI-USB-SMD_MINI-5PTP
  rect 0.5x2.2 smd: 1(-1.6,2.95) 2(-0.8,2.95) 3(0,2.95) 4(0.8,2.95) 5(1.6,2.95)
  rect 2x2.2 smd: 6(-4.45,2.55) 7(4.45,2.55) 8(4.45,-2.95) 9(-4.45,-2.95)
R0402
  rect 0.566x0.54 smd: 1(-0.433,0) 2(0.433,0)
R0603
  rect 0.806x0.864 smd: 1(-0.753,0) 2(0.753,0)
R0805
  rect 1.133x1.377 smd: 1(-1,0) 2(1,0)
SMA_L4.2-W2.6-LS5.0-RD_1
  rect 1.52x1.68 smd: 1(-1.965,0) 2(1.965,0)
SMA_L4.3-W2.6-LS5.2-RD
  rect 2x2 smd: 1(-2.2,0) 2(2.2,0)
SOIC-8_L4.9-W3.9-P1.27-LS6.0-BL
  oval 0.588x2.045 smd: 1(-1.905,-2.57) 2(-0.635,-2.57) 3(0.635,-2.57) 4(1.905,-2.57) 5(1.905,2.57) 6(0.635,2.57) 7(-0.635,2.57) 8(-1.905,2.57)
SOIC-8_L5.3-W5.3-P1.27-LS8.0-BL
  oval 0.63x2.25 smd: 1(-1.905,-3.53) 2(-0.635,-3.53) 3(0.635,-3.53) 4(1.905,-3.53) 5(1.905,3.53) 6(0.635,3.53) 7(-0.635,3.53) 8(-1.905,3.53)
SOT-23-5_L2.9-W1.6-P0.95-LS2.8-BL
  rect 0.6x1 smd: 1(-0.95,-1.1) 2(0,-1.1) 3(0.95,-1.1) 4(0.95,1.1) 5(-0.95,1.1)
SSOP-10_L4.9-W3.9-P1.00-LS6.0-BL
  oval 0.525x2.014 smd: 1(-2,-2.756) 2(-1,-2.756) 3(0,-2.756) 4(1,-2.756) 5(2,-2.756) 6(2,2.756) 7(1,2.756) 8(0,2.756) 9(-1,2.756) 10(-2,2.756)
TO-252-3_L6.5-W5.8-P4.60-LS9.9-BR
  rect 2.219x1.064 smd: 1(3.498,-2.3) 3(3.498,2.3)
  rect 5.5x5.553 smd: 2(-3.498,0)
WIRELM-SMD_E22-900M22S
  rect 1.8x0.9 smd: 1(7,-8.5) 2(7,-7.23) 3(7,-5.96) 4(7,-0.39) 5(7,0.88) 6(7,2.15) 7(7,3.42) 8(7,4.69) 9(7,5.96) 10(7,7.23) 11(7,8.5) 12(-7,8.5) 13(-7,7.23) 14(-7,5.96) 15(-7,4.69) 16(-7,3.42) 17(-7,2.15) 18(-7,0.88) 19(-7,-0.39) 20(-7,-5.96) 21(-7,-7.23) 22(-7,-8.5)

## Nets
As in the schematic.

Pads without a net: U3 5 6 28; U5 21; U23 4; U24 4; USB1 4

## Via types
v1: diameter 0.61, hole 0.305, Top Layer to Bottom Layer, 177 vias

## Routing (per net, layer and track width the routed paths; a pad name or vN(x,y) marks a point on that pad's centre or on a via; arc(x,y) is an arc through that point)
GND: length 375.2
  Top Layer w0.254: LED2.1 46.47,33.44 46.8,33.44 ; 67.52,15.02 67.52,15.74 R49.1 ; 67.52,15.02 68.79,15.02 69.05,15.28 69.05,16.04 68.03,17.06 64.64,17.06 C42.1 C43.1 64.55,20.19 62.73,22.02 62.52,22.02 ; 67.52,15.02 67.52,12.74 ; 58.93,15.84 C40.1 ; 58.93,15.84 59.33,15.84 v1(59.69,16.2) ; 58.93,15.84 57.66,14.57 C35.2 57.4,13.12 C44.1 59.56,10.96 C45.1 63.28,10.96 63.88,10.36 ; U3.47 55.97,17.98 v1(56.13,18.14) ; 6.85,3.51 8.12,3.51 8.12,4.33 9.39,5.6 U10.6 9.61,8.86 C49.2 9.61,11.09 10.07,11.56 ; C60.2 27.37,13.86 27.56,13.68 ; 9.55,25.92 10.57,26.94 25.81,26.94 27.56,25.19 27.56,24.17 25.3,21.91 C66.1 ; 9.55,25.92 9.55,25.67 9.15,25.27 USB1.7 9.15,22.07 7.38,20.29 ; 9.55,25.92 USB1.5 8.61,26.85 5.74,29.71 5.74,31.01 ; C50.1 63.21,33.14 63.58,32.77 68.15,32.77 v1(78.82,22.1) 79.88,22.1 U5.3 ; U20.1 7.84,16.99 7.88,16.99 ; U3.35 v1(48.32,18.45) 45.02,15.15 36.91,15.15 D11.2 34.42,12.66 28.58,12.66 27.56,13.68 ; 63.88,10.36 66.25,12.74 67.52,12.74 ; 63.88,10.36 63.88,9.6 ; 51.11,26.02 51.11,27.86 R24.1 54.1,32.03 U9.4 ; 51.11,26.02 50.61,26.02 50.35,25.76 49.59,25.76 ; 51.11,26.02 51.47,25.66 U3.23 ; 5.74,31.01 5.54,31.01 USB1.9 ; 5.74,31.01 7.63,32.9 USB1.6 17.91,32.9 22.1,37.08 ; USB1.8 7.36,20.29 7.38,20.29 ; 62.52,22.02 61.76,22.02 61,21.26 60.41,21.26 ; 62.52,22.02 62.52,23.24 61.72,24.04 C38.2 ; C37.2 49.28,16.93 v1(49.28,16.36) 49.28,15.79 C39.2 49.44,14.35 48.43,13.34 48.43,12.32 48.73,12.01 R31.1 ; 7.88,16.99 10.07,14.8 10.07,11.56 ; 7.88,16.99 7.38,17.5 7.12,17.5 6.87,17.75 6.87,19.78 7.38,20.29 ; 81.53,9.86 81.53,14.88 80.77,15.64 U5.5 U5.4 80.16,17.02 76.03,17.02 ; 81.53,9.86 81.79,9.86 88.9,2.75 ; 81.53,9.86 80.52,8.85 ; 70.5,3.66 70.5,1.79 H4.1 ; 70.5,3.66 67.43,3.66 C51.1 63.5,4.79 ; 70.5,3.66 C11.1 75.44,8.59 77.47,8.59 ; 47.12,22.66 47.01,22.77 v1(46.54,22.77) ; 16.63,14.86 16.88,15.11 16.88,19.18 15.76,20.3 U19.2 ; 16.63,14.86 18.66,14.86 R56.2 20.06,14.99 21.76,14.99 22.01,14.73 22.01,14.22 25.06,11.18 25.31,11.18 26.84,12.7 C62.1 27.56,13.68 ; 16.63,14.86 C65.1 14.9,14.61 11.85,11.56 10.07,11.56 ; 76.03,17.02 76.03,18.29 BT2.1 ; 76.03,17.02 76.03,14.65 ; 80.26,8.59 U5.11 ; 80.26,8.59 80.52,8.85 ; 80.26,8.59 77.47,8.59 ; 93.22,22.48 U5.20 ; 93.22,22.48 U5.3 ; 93.22,22.48 92.96,22.74 92.96,24.23 93.75,25.02 U5.22 ; 63.88,9.6 64.51,8.98 C48.1 ; 63.88,9.6 63.3,9.02 U24.2 ; 60.41,21.26 C36.2 ; 60.41,21.26 60.22,21.45 U3.8 ; 63.5,4.79 62.74,4.79 U23.2 ; 63.5,4.79 63.5,3.26 63.25,3.01 62.05,3.01 60.83,4.23 C46.1 59.51,4.74 59.44,4.66 ; R36.1 76.03,13.37 R35.1 68.29,13.25 67.78,12.74 67.52,12.74 ; v1(47.81,28.1) 46.8,29.12 46.8,33.44 ; 80.52,8.85 80.52,9.04 U5.10 ; 88.9,2.75 88.99,2.75 U5.12 ; 88.9,2.75 89.74,1.91 H3.1 ; LED1.1 46.8,33.57 46.8,33.44 ; U5.3 U5.2 U5.1 ; 49.59,25.76 C34.2 ; 49.59,25.76 v1(49.59,26.33) ; 77.47,8.59 77.47,8.55 C10.1
  Signal w0.254: v1(46.54,22.77) 46.54,23.28 v1(49.59,26.33) v1(47.81,28.1) ; BT2.1 v1(78.82,22.1)
  Bottom Layer w0.254: v1(59.69,16.2) 58,17.88 56.39,17.88 v1(56.13,18.14) 55.88,18.39 49.28,18.39 ; 49.28,18.39 v1(49.28,16.36) ; 49.28,18.39 48.89,18.39 48.83,18.45 v1(48.32,18.45) 48.83,18.96 48.83,20.48 v1(46.54,22.77)
  vias: v1(5.34,35.82) v1(5.34,30.74) v1(5.34,25.66) v1(5.34,20.58) v1(5.34,15.5) v1(5.34,5.34) v1(10.42,35.82) v1(10.42,25.66) v1(10.42,20.58) v1(10.42,15.5) v1(15.5,35.82) v1(15.5,25.66) v1(15.5,15.5) v1(20.58,35.82) v1(25.66,35.82) v1(25.66,25.66) v1(30.74,35.82) v1(30.74,30.74) v1(30.74,25.66) v1(30.74,15.5) v1(35.82,30.74) v1(35.82,25.66) v1(35.82,15.5) v1(40.9,35.82) v1(40.9,25.66) v1(40.9,20.58) v1(40.9,15.5) v1(45.98,35.82) v1(45.98,20.58) v1(45.98,15.5) v1(45.98,10.42) v1(51.06,30.74) v1(51.06,10.42) v1(51.06,5.34) v1(56.14,35.82) v1(56.14,30.74) v1(56.14,10.42) v1(61.22,30.74) v1(61.22,25.66) v1(61.22,15.5) v1(66.3,35.82) v1(66.3,30.74) v1(66.3,25.66) v1(66.31,21.4) v1(66.3,15.5) v1(71.38,30.74) v1(71.38,25.66) v1(71.39,21.4) v1(71.38,20.58) v1(71.39,16.32) v1(71.38,15.5) v1(71.38,10.42) v1(71.38,5.34) v1(76.46,35.82) v1(76.46,30.74) v1(76.46,25.66) v1(76.46,15.5) v1(76.46,5.34) v1(81.54,35.82) v1(81.54,30.74) v1(81.54,25.66) v1(81.54,20.58) v1(81.54,5.34) v1(86.62,35.82) v1(86.62,30.74) v1(86.62,25.66) v1(86.62,20.58) v1(86.62,15.5) v1(86.62,10.42) v1(86.62,5.34) v1(91.7,35.82) v1(91.7,30.74) v1(91.7,25.66) v1(91.7,20.58) v1(91.7,15.5) v1(91.7,5.34) v1(96.78,35.82) v1(96.78,30.74) v1(96.78,25.66) v1(96.78,20.58) v1(96.78,15.5) v1(96.78,10.42) v1(96.78,5.34)
VBUS: length 119.4
  Top Layer w0.254: R25.2 47.1,19.36 46.1,19.36 45.34,20.13 45.34,22.16 37.72,29.78 D10.2 ; v1(52.7,9.71) 55.25,9.71 55.94,9.02
  Top Layer w0.61: D10.2 17.89,30.05 USB1.1 ; v1(51.82,9.02) 55.94,9.02 D14.2 ; v1(7.75,30.1) 9.5,30.1 USB1.1 ; USB1.1 9.55,30.7 v1(9.27,30.99) ; v1(44.07,14.35) 45.72,12.7 v1(45.72,11.94)
  Signal w0.254: v1(45.34,17.08) v1(47.88,14.54)
  Bottom Layer w0.254: v1(45.34,17.08) 46.36,18.09 v1(46.36,19.36) ; v1(47.88,14.54) v1(52.7,9.71)
  Bottom Layer w0.61: v1(45.72,11.94) 48.64,9.02 v1(51.82,9.02) ; v1(44.07,14.35) 27.43,30.99 v1(9.27,30.99)
VCC: length 336.8
  Top Layer w0.254: 51.47,23.07 51.14,22.74 51.64,22.23 51.64,19.11 50.88,18.35 50.63,18.35 50.23,17.95 U3.36 ; 51.47,23.07 51.48,23.08 51.48,23.67 50.97,24.17 U3.24 49.76,24.95 C34.1 ; 51.47,23.07 54.36,23.07 55.71,21.72 55.71,21.21 ; C37.1 48.35,17.27 49.03,17.95 49.28,17.95 ; v1(58.5,9.97) 56.79,11.68 R40.2 55.42,12.32 55.17,12.57 ; 11.45,10.9 11.88,10.9 12.13,10.65 25.59,10.65 26,11.05 45.81,11.05 46.32,11.56 46.32,13.84 48.09,15.62 C39.1 ; C38.1 60.33,22.06 C36.1 60.27,21.95 U3.9 56.45,21.95 55.71,21.21 ; U9.8 U9.7 60.61,34.67 59.33,33.4 U9.3 53.91,33.49 50.93,33.49 ; 32.26,37.08 47.76,37.08 R29.2 ; C35.1 57.36,15.37 57.2,15.37 ; 57.2,15.37 56.69,14.86 56.69,13.84 55.42,12.57 55.17,12.57 ; 57.2,15.37 57.2,15.72 ; 64.88,5.63 U23.5 64.09,5.65 v1(63.58,6.16) ; 78.63,10.56 78.22,10.56 C10.2 ; 69.38,5.63 69.55,5.63 73.8,9.88 ; 10.61,10.9 10.61,8.7 U10.5 ; U3.48 57.74,17.72 ; 57.74,17.72 57.49,17.72 55.45,19.75 55.45,20.96 55.71,21.21 ; 57.74,17.72 U3.1 57.97,17.89 ; 55.17,12.57 R41.1 ; 62.1,34.67 63.03,34.67 64.05,33.66 69.72,33.66 ; 49.4,24.85 48.89,25.36 48.89,26.63 50.42,28.16 50.42,32.22 50.93,32.73 50.93,33.4
  Top Layer w0.355: v1(11.81,10.54) 11.45,10.9 10.45,10.9 10.66,10.69 U10.5 ; U5.9 78.63,10.56 77.95,9.88 C10.2 C11.2 75.3,9.91 v1(73.66,9.91) 69.38,5.63 v1(67.47,5.63) C51.2 ; U12.2 69.47,33.4 C50.2 64.05,34.25 v1(62.86,35.43) ; U3.24 50.87,24.85 C34.1 49.36,24.85 v1(48.51,24) ; v1(50.17,32.64) 50.93,33.4 R29.2 51.93,33.92 52.45,33.4 U9.3 ; 48.35,15.88 48.22,16 v1(47.63,16) ; 48.35,15.88 C37.1 48.61,17.28 48.61,17.42 48.8,17.62 48.95,17.62 49.28,17.95 U3.36 ; 48.35,15.88 C39.1 ; U9.8 62.36,35.94 v1(62.86,35.43) ; v1(62.86,35.43) 62.1,34.67 U9.7 ; U3.1 59.05,16.87 C40.2 58.79,16.54 58.65,16.54 58.5,16.4 v1(57.75,16.4) 57.75,15.75 C35.1 57.4,15.52 57.2,15.72 U3.48
  Top Layer w0.61: C51.2 66.27,5.65 U23.5
  Bottom Layer w0.254: v1(58.5,9.97) 62.31,6.16 v1(63.58,6.16)
  Bottom Layer w0.355: v1(62.86,35.43) 62.86,35.25 54.57,26.95 54.07,26.95 53.72,27.31 53.72,29.08 v1(50.17,32.64) 48.51,30.99 v1(48.51,24) ; 32.26,37.08 32.89,37.08 v1(34.42,35.56) 36.96,35.56 48.39,24.13 ; v1(11.81,10.54) 42.16,10.54 47.53,15.91 ; v1(57.75,16.4) 57.94,16.21 57.94,12.7
  Bottom Layer w0.61: v1(67.47,5.63) 60.4,12.7 v1(55.75,12.7) 50.93,12.7 v1(47.63,16) 47.53,15.91 46.64,15.91 46.29,16.26 44.96,16.26 43.54,17.67 43.54,23.1 44.58,24.13 48.39,24.13 v1(48.51,24)
VCC_BAT_IN: length 161
  Top Layer w0.254: v1(50.86,13.9) R30.2 ; R54.2 24.18,16.4
  Top Layer w0.61: U19.7 22.1,18.3 R54.2 25.8,14.61 C60.1 25.97,12.98 C62.2 26,12.79 v1(25.15,11.94) ; v1(49.03,2.03) H5.3
  Signal w0.254: 49.09,13.9 45.79,13.9 41.38,18.3 v1(22,18.3) ; 49.09,13.9 47.05,11.86 47.05,6.03 H5.3 ; 49.09,13.9 v1(50.86,13.9)
  Bottom Layer w0.254: BT2.2 4.98,17.03 13.62,17.03 14.89,18.3 v1(22,18.3)
  Bottom Layer w0.61: v1(25.15,11.94) 7.24,11.94 3.22,15.96 BT2.2 2.16,17.73 2.16,14.61 11.56,5.21 45.72,5.21 48.89,2.03 v1(49.03,2.03)
VCC_IN: length 40.8
  Top Layer w0.254: C45.2 60.58,10.25 C44.2 ; 61.84,4.56 61.84,4.31 62.4,3.75 U23.3 62.28,4.12 62.04,4.12 61.88,4.28 61.88,4.53 61.84,4.56 ; 61.84,4.56 61.84,4.78 61.5,5.12 ; 61.84,4.56 61.5,4.91 61.5,5.12 ; 61.5,5.12 61.5,5.58 ; 61.5,5.12 61.04,5.58 61.88,6.41 61.88,6.67 ; 61.11,9.97 60.61,9.46 60.61,7.94 61.88,6.67 ; 61.88,6.67 62.65,5.89 U23.1 ; 53.59,4.18 55.25,5.83 59.31,5.83 ; 59.51,5.58 C47.2
  Top Layer w0.61: 58.46,6.48 54.86,6.48 53.59,5.21 H5.2 ; 58.46,6.48 59.1,5.83 C47.2 60.76,5.5 60.83,5.58 62.58,5.58 U23.1 ; 58.46,6.48 59.44,7.45 59.44,8.85 ; 59.44,8.85 C45.2 60.86,9.97 U24.1 ; 59.44,8.85 C44.2
VCC_SENSE: length 83.1
  Top Layer w0.254: R39.2 39.75,7.06 R38.2 42.42,7.31 v1(47.83,7.31) ; v1(71.12,8.51) 69.81,9.82 66.17,9.82 ; 64.88,9.82 U24.5
  Top Layer w0.61: U24.5 66.02,9.97 66.17,9.82 67.78,11.43 v1(77.34,11.43) ; H3.4 82.93,2.41 v1(78.74,6.6) 78.74,2.41 H4.4
  Signal w0.254: v1(47.83,7.31) 69.92,7.31 v1(71.12,8.51) H4.4 78.23,1.91 H3.4
  Bottom Layer w0.61: v1(78.74,6.6) 78.74,10.03 v1(77.34,11.43)
BAT_CHRG: length 47.3
  Top Layer w0.254: U3.31 50.23,20.45 v1(51,19.69) ; v1(16.2,16.51) 16.45,16.76 16.45,18.77 15.91,19.3 U19.3
  Signal w0.254: v1(16.2,16.51) 18.74,19.05 44.39,19.05 46.42,17.02 52.27,17.02 52.77,17.53 52.77,17.91 v1(51,19.69)
BAT_SENSE: length 9.4
  Top Layer w0.254: 50.19,13.66 50.81,13.03 R30.1 ; 50.19,13.66 49.8,13.66 R31.2 ; 50.19,13.66 50.19,14.17 50.69,14.67 v1(50.69,14.93) ; v1(51.96,17.72) 52.47,17.21 U3.40
  Bottom Layer w0.254: v1(51.96,17.72) 51.96,16.2 v1(50.69,14.93)
BAT_STDBY: length 41.5
  Top Layer w0.254: v1(13.81,18.3) U19.4 ; U3.29 48.71,21.45 47.69,22.47 47.69,23.23 47.44,23.48 45.15,23.48 v1(43.88,24.75)
  Signal w0.254: v1(38.8,20.94) 16.45,20.94 v1(13.81,18.3)
  Bottom Layer w0.254: v1(43.88,24.75) 42.61,24.75 v1(38.8,20.94)
BOOT: length 33.3
  Top Layer w0.254: v1(54.1,22.41) 54.73,21.79 54.73,17.47 54.47,17.21 U3.44 ; v1(54.36,28.5) 54.36,29.09 R24.2
  Signal w0.254: v1(54.1,22.41) 54.1,28.25 v1(54.36,28.5)
  Bottom Layer w0.254: 70.61,37.08 63.44,37.08 54.86,28.5 v1(54.36,28.5)
E22_BUSY: length 53.3
  Top Layer w0.254: v1(58.81,28.51) 55.51,28.51 52.97,25.97 U3.20 ; v1(95.53,10.59) 94.28,10.59 U5.14
  Signal w0.254: v1(58.81,28.51) 77.61,28.51 v1(95.53,10.59)
E22_DIO1: length 50
  Top Layer w0.254: v1(91.82,11.23) 93.76,9.29 U5.13 ; v1(58.04,27.75) 57.78,28 55.75,28 53.97,26.22 U3.18
  Signal w0.254: v1(58.04,27.75) 75.31,27.75 v1(91.82,11.23)
E22_DIO2: length 33.2
  Top Layer w0.254: v1(67.35,12.09) 80.01,12.09 U5.8 ; U3.19 v1(53.47,23.68)
  Bottom Layer w0.254: v1(53.47,23.68) 53.98,23.68 65.83,11.83 67.1,11.83 v1(67.35,12.09)
E22_MISO: length 51.7
  Top Layer w0.254: U5.16 94.78,13.1 95.53,13.86 95.53,17.41 95.28,17.67 82.32,17.67 73.51,26.48 58.27,26.48 57.44,27.31 55.81,27.31 54.97,26.48 U3.16
E22_MOSI: length 45
  Top Layer w0.254: v1(56,22.92) 55.74,22.92 54.47,24.19 U3.17 ; v1(82.32,14.37) U5.17
  Bottom Layer w0.254: v1(82.32,14.37) 82.07,14.63 68.1,14.63 66.41,16.31 64.12,16.31 57.01,23.43 56.5,23.43 v1(56,22.92)
E22_NRST: length 44.8
  Top Layer w0.254: v1(53.5,15.18) 52.23,15.18 51.97,15.44 U3.39 ; v1(82.15,11.83) U5.15
  Signal w0.254: v1(53.5,15.18) 59.85,15.18 62.33,12.69 81.29,12.69 v1(82.15,11.83)
E22_NSS: length 43.1
  Top Layer w0.254: U5.19 82.04,16.91 74.26,24.7 59.78,24.7 59.02,23.94 56.73,23.94 56.48,23.68 56.23,23.68 55.97,23.94 U3.14
E22_RXEN: length 27.2
  Top Layer w0.254: v1(76.77,14) 76.77,14.51 R36.2 79.99,14.64 U5.6 ; U3.10 59.75,22.45 v1(60.26,22.96)
  Signal w0.254: v1(76.77,14) 69.47,14 65.34,18.13 65.34,18.64 61.02,22.96 v1(60.26,22.96)
E22_SCK: length 44.6
  Top Layer w0.254: v1(82.31,15.64) 82.81,16.15 93.75,16.15 U5.18 ; v1(60.04,25.46) 58.52,25.46 57.76,26.22 55.98,26.22 55.47,25.71 U3.15
  Bottom Layer w0.254: v1(60.04,25.46) 64.87,20.63 67.92,20.63 72.4,16.15 81.8,16.15 v1(82.31,15.64)
E22_TXEN: length 28.3
  Top Layer w0.254: R35.2 77.03,13.25 v1(77.48,13.7) 78.08,13.1 U5.7 ; v1(60.51,23.71) 60,23.71 59.24,22.95 U3.11
  Signal w0.254: v1(60.51,23.71) 64.83,23.71 73.72,14.82 76.97,14.82 77.48,14.31 v1(77.48,13.7)
FLASH_CLK: length 20.6
  Top Layer w0.254: U9.6 60.52,33.4 59.58,32.45 59.58,28.14 v1(58.56,27.12) ; U3.41 52.97,19.25 v1(53.99,20.26)
  Signal w0.254: v1(53.99,20.26) 55.26,21.53 55.26,23.82 v1(58.56,27.12)
FLASH_CS: length 16
  Top Layer w0.254: U3.25 49.47,23.7 v1(49.73,23.96) ; R29.1 v1(51.69,34.66) 52.97,35.94 U9.1
  Signal w0.254: v1(51.69,34.66) 51.69,25.92 v1(49.73,23.96)
FLASH_DI: length 12.7
  Top Layer w0.254: v1(52.73,26.73) 52.47,26.48 U3.21 ; v1(60.23,31.3) U9.5
  Bottom Layer w0.254: v1(60.23,31.3) 55.41,26.48 52.98,26.48 v1(52.73,26.73)
FLASH_DO: length 14.1
  Top Layer w0.254: U9.2 53.42,34.09 v1(52.73,34.09) ; U3.22 51.97,24.19 v1(52.48,23.68)
  Signal w0.254: v1(52.48,23.68) 53.5,24.7 53.5,33.33 v1(52.73,34.09)
GPS_RX: length 39
  Top Layer w0.254: v1(56.77,22.73) 56.77,22.99 57.23,23.45 U3.12
  Bottom Layer w0.254: v1(56.77,22.73) 63.63,15.88 64.9,15.88 76.07,4.7 82.68,4.7 H3.3
GPS_TX: length 44.1
  Top Layer w0.254: v1(57.09,24.7) 56.73,24.7 U3.13
  Signal w0.254: v1(57.09,24.7) 64.97,24.7 73.02,16.64 78.36,16.64 88.01,6.98 H3.2
I2C_SCL: length 50
  Top Layer w0.254: R39.1 40.4,8.58 47.68,8.58 50.73,11.62 51.24,11.62 52.51,12.9 v1(52.51,14.42) ; v1(54.03,17.72) 53.47,17.16 U3.42
  Bottom Layer w0.254: H4.3 72.39,4.7 70.36,4.7 57.59,17.47 55.05,17.47 54.8,17.72 v1(54.03,17.72) 52.51,16.2 v1(52.51,14.42)
I2C_SDA: length 41.4
  Top Layer w0.254: 42.16,7.93 47.68,7.93 50.8,11.05 51.56,11.05 v1(52.32,11.81) ; U3.43 53.97,15.69 54.1,15.56 54.1,15.05 v1(54.61,14.54)
  Signal w0.254: v1(59.18,13.59) 58.17,14.61 56.13,14.61 55.88,14.35 54.86,14.35 ; v1(54.61,14.54) 54.8,14.35 54.86,14.35 ; 54.86,14.35 v1(52.32,11.81)
  Bottom Layer w0.254: v1(59.18,13.59) 60.71,13.59 72.64,1.65 H4.2
INA_SCL: length 51.9
  Top Layer w0.254: 10.66,3.51 44.98,3.51 53.03,11.56 53.03,12.32 R41.2 53.8,13.34 54.21,13.75 54.72,13.75 55.23,14.26 55.23,14.93 54.97,15.18 U3.45
INA_SDA: length 63.5
  Top Layer w0.254: v1(55.47,13.66) 55.73,13.91 55.73,15.18 55.47,15.44 U3.46 ; v1(53.95,11.88) 54.14,11.68 54.4,11.68 ; 54.4,11.68 R40.1 ; 54.4,11.68 54.98,11.1 56.5,11.1 57.44,10.16 57.44,7.87 56.68,7.11 49.32,7.11 44.24,2.03 10.36,2.03 9.39,3 9.39,3.51
  Signal w0.254: v1(55.47,13.66) 55.47,13.4 v1(53.95,11.88)
INA_VIN: length 7.3
  Top Layer w0.254: U20.2 2.04,8.65 U10.8 6.85,10.7 R58.2
INA_VOUT: length 6.3
  Top Layer w0.254: U10.7 8.12,10.7 R58.1 7.92,14.72 D9.2
LINK_CLK: length 32.9
  Top Layer w0.254: v1(50.8,17.64) 50.8,16.62 U3.37
  Signal w0.254: H1.3 46.62,17.64 v1(50.8,17.64)
LINK_DIO: length 29.4
  Top Layer w0.254: U3.34 49.53,19.01 v1(50.55,19.01)
  Signal w0.254: H1.4 30.48,37.08 48.55,19.01 v1(50.55,19.01)
LINK_RST: length 50.9
  Top Layer w0.254: U3.7 57.02,20.95 56.9,20.83 56.9,20.32 v1(56.39,19.81) ; v1(61.82,21.18) C41.2
  Signal w0.254: v1(61.82,21.18) 57.76,21.18 v1(56.39,19.81) 55.88,19.81 55.63,19.56 53.85,19.56 52.07,21.34 46.99,21.34 45.72,22.61 45.72,25.4 32.77,38.35 25.91,38.35 H1.2
SENSE_LDO_EN: length 19.9
  Top Layer w0.254: 61.34,8.13 62.47,8.13 62.52,8.07 ; v1(61.38,8.07) 62.52,8.07 ; 62.52,8.07 U24.3 ; 51.47,15.11 U3.38 51.44,16.42 51.47,15.11 ; 51.47,15.11 v1(51.47,14.67)
  Signal w0.254: v1(61.38,8.07) 56.55,8.07 54.27,10.36 52.74,10.36 51.47,11.62 v1(51.47,14.67)
SOLAR_IN: length 36.1
  Top Layer w0.254: 19.9,20.3 U19.9 ; 19.9,20.3 18.2,22.01 C59.1 18.2,22.99 18.16,23.03 18.16,23.28 ; 19.9,20.3 19.14,19.54 v1(19.14,17.26) ; 18.16,23.28 D10.1 ; 18.16,23.28 17.91,23.53 12.32,23.53 8,19.22 D9.1 ; R55.2 21.17,14.27 v1(20.41,14.27)
  Top Layer w0.61: Q1.3 25.51,20.51 C66.2 23.56,20.32 v1(22.23,20.32) 22.21,20.3 U19.9 ; v1(19.18,22.48) 18.92,22.73 C59.1 ; D10.1 19.75,25.85 v1(20.19,25.4)
  Signal w0.254: v1(19.14,17.26) 19.14,15.54 v1(20.41,14.27)
USB_DP: length 40.9
  Top Layer w0.254: R28.2 12.92,27.83 34.48,27.83 43.63,18.69 47.44,18.69 48.2,19.45 U3.33
USB_V_SENSE: length 3.8
  Top Layer w0.254: R26.2 47.95,20.96 47.95,20.95 ; 47.95,20.95 47.82,20.95 R25.1 ; 47.95,20.95 U3.30
$1N4771: length 2.6
  Top Layer w0.254: USB1.3 11.44,28.45 R28.1
$1N10468: length 9.6
  Top Layer w0.254: U3.26 50.23,22.95 v1(50.74,23.46) ; v1(49.22,28.03) 49.22,28.33 R33.1
  Bottom Layer w0.254: v1(50.74,23.46) 50.74,26.51 v1(49.22,28.03)
$1N10470: length 9.6
  Top Layer w0.254: U3.27 48.71,22.45 48.2,22.96 48.2,23.47 45.97,25.69 R32.1
$1N10516: length 1.8
  Top Layer w0.254: LED1.2 47.5,31.17 R33.2
$1N10562: length 2
  Top Layer w0.254: R32.2 45.56,31.45 LED2.2
$1N10899: length 6.6
  Top Layer w0.254: C42.2 63.58,17.01 X6.2 59.66,18.95 U3.3
$1N10903: length 5.9
  Top Layer w0.254: U3.4 61.48,19.45 X6.1 63.34,19.56 C43.2
$1N31992: length 40.5
  Top Layer w0.254: R37.2 13.4,28.59 34.48,28.59 40.83,22.24 v1(44.39,22.24) ; v1(48.2,20.2) 48.45,19.95 U3.32
  Bottom Layer w0.254: v1(48.2,20.2) 46.17,22.24 v1(44.39,22.24)
$1N32156: length 2.4
  Top Layer w0.254: R37.1 11.87,29.25 USB1.2
$1N34283: length 12.2
  Top Layer w0.254: R49.2 68.29,15.83 68.29,16 67.79,16.51 67.28,16.51 66.93,16.17 60.51,16.17 60.26,16.42 60.26,16.93 58.73,18.45 U3.2
$1N35924: length 6.7
  Top Layer w0.254: U19.10 24.01,24.65 Q1.1
$1N35929: length 14.7
  Top Layer w0.254: 32.89,17.57 32.89,22.28 Q1.2
  Top Layer w0.61: Q1.2 34.92,20.39 D11.1 30.63,17.57 L2.2
$1N36102: length 12.2
  Top Layer w0.508: L2.1 30.61,14.1 26.31,18.4 R54.1 23.1,19.3 U19.8
$1N36152: length 5
  Top Layer w0.254: R56.1 18.8,16.5 20.45,16.5 20.7,16.25 ; R55.1 20.7,16.25 ; 20.7,16.25 20.7,17.27 U19.6
$1N36318: length 2.8
  Top Layer w0.61: C59.2 16.58,22.73 U19.1
$1N36427: length 1.4
  Top Layer w0.254: R57.1 14.06,16.12 C65.2
$1N36456: length 1.2
  Top Layer w0.254: 14.84,16.2 15.15,16.52 U19.5
$1N41677: length 3
  Top Layer w0.254: 56.13,4.64 D14.1
  Top Layer w0.61: H5.1 56.26,2.16 D14.1

## Copper pours and planes (outline as drawn; the poured copper is in the pictures)
GND on GND: 0.26,38.86 97.41,38.86 97.41,0.26 0.26,0.26
SOLAR_IN on Bottom Layer: 16.86,26.7 26.54,26.7 26.54,18.03 16.86,18.03

Small or netless copper shapes (teardrops, artwork), in the pictures only: 20 on GND

## Text on the board
Top Silkscreen Layer: Prog | Vcc | + | RX | TX | G | GPS | Boot | SDA | SCL | Solar In | I2C | V+ | GND | STM32 SX1262 / Achuthan 2026 / Saturn V1.0
